# Altium schematic sheet [01] - CoverSheet.SchDoc
size A3; Engineer: Derryn Harvie; Revision: 0.2; SheetNumber: 1
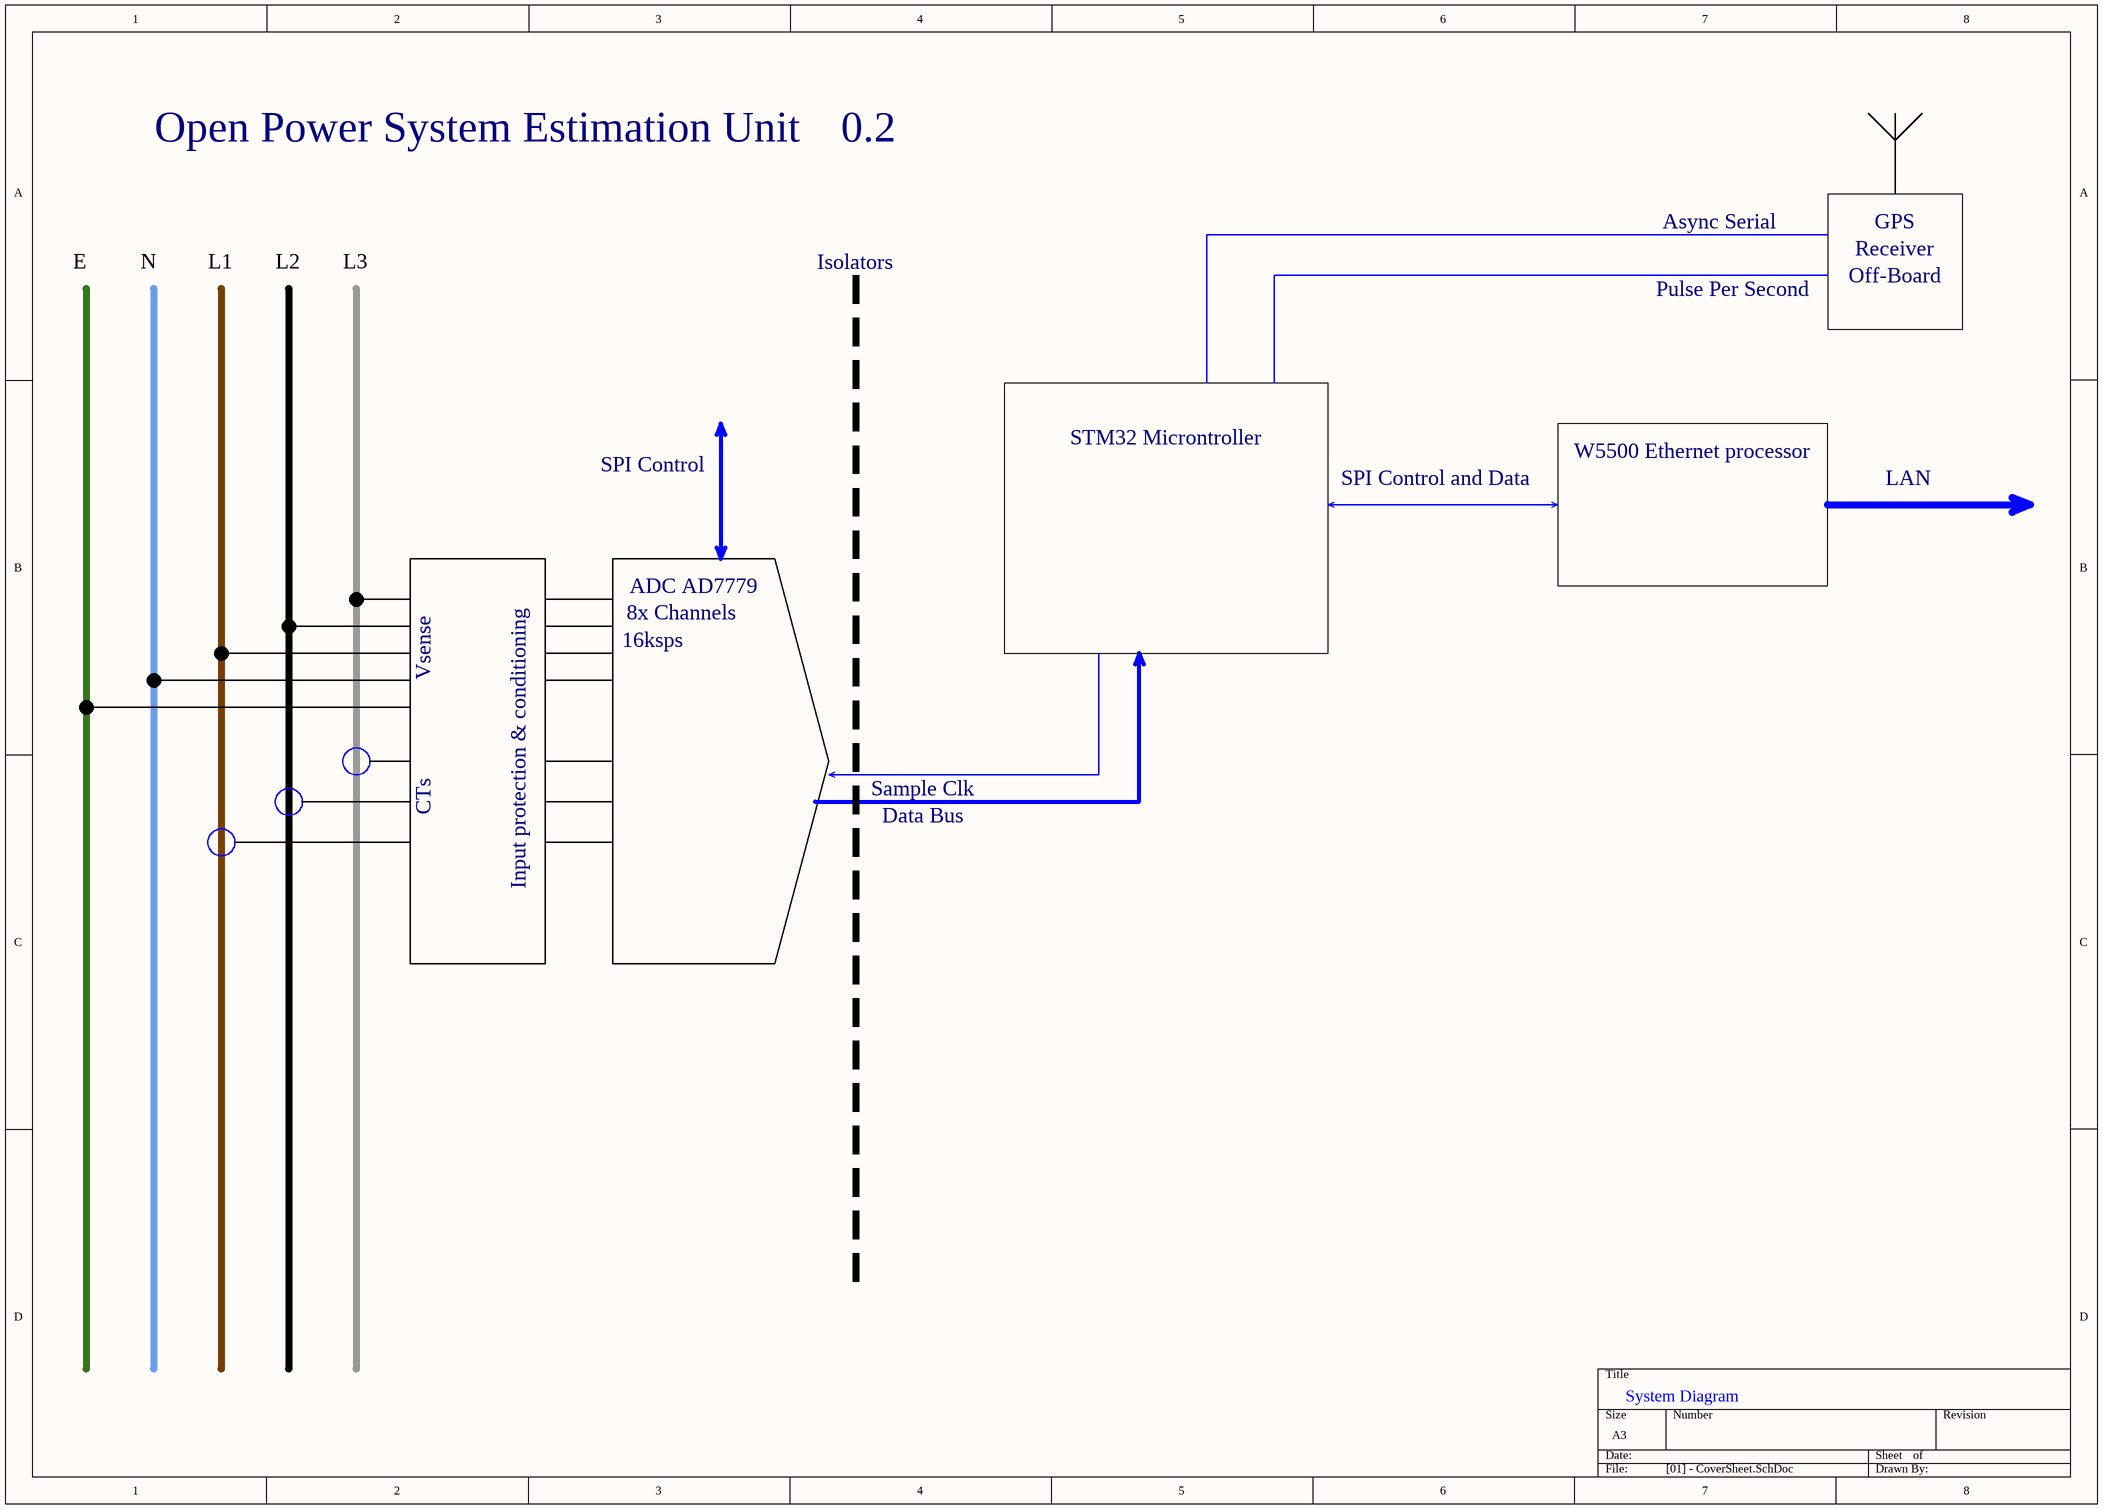
[diagram p0: [01] - CoverSheet.SchDoc]

## Notes on the sheet
- Open Power System Estimation Unit
- Async Serial
- GPS
- Receiver
- E
- N
- L1
- L2
- L3
- Isolators
- Pulse Per Second
- Off-Board
- STM32 Microntroller
- W5500 Ethernet processor
- SPI Control
- SPI Control and Data
- LAN
- ADC AD7779
- 8x Channels
- 16ksps
- Vsense
- Input protection & conditioning
- Sample Clk
- CTs
- Data Bus
- System Diagram